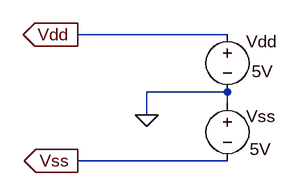
[diagram p0: schematic tpower.asc]
tpower.asc, the LTspice schematic file:
Version 4
SHEET 1 880 680
WIRE -112 32 -320 32
WIRE -112 112 -224 112
WIRE -112 128 -112 112
WIRE -224 144 -224 112
WIRE -112 208 -320 208
FLAG -224 144 0
FLAG -320 32 Vdd
IOPIN -320 32 Out
FLAG -320 208 Vss
IOPIN -320 208 Out
SYMBOL voltage -112 16 R0
WINDOW 0 26 26 Left 0
WINDOW 3 34 68 Left 0
SYMATTR InstName Vdd
SYMATTR Value 5V
SYMBOL voltage -112 112 R0
WINDOW 0 26 34 Left 0
WINDOW 3 31 80 Left 0
SYMATTR InstName Vss
SYMATTR Value 5V

The netlist it stands for:
* tpower.asc
Vdd Vdd 0 5V
Vss 0 Vss 5V
.backanno
.end